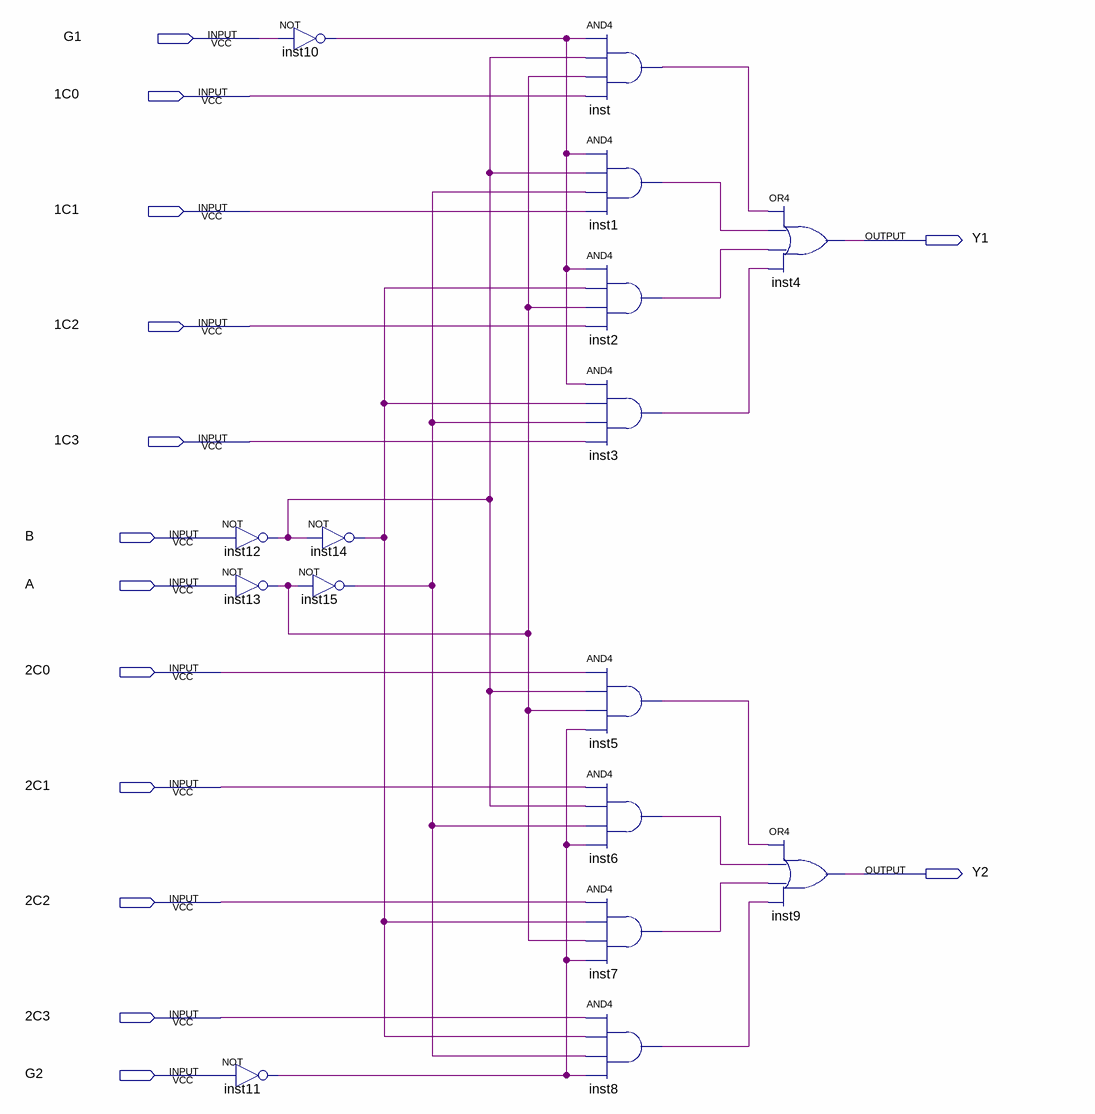
[diagram p0: schematic sheet]
// Quartus schematic ci74153.bdf as structural Verilog: 16 symbols, 14 pins
module ci74153 (
  input  G1,
  input  \1C0 ,
  input  \1C1 ,
  input  \1C2 ,
  input  \1C3 ,
  input  B,
  input  A,
  input  \2C0 ,
  input  \2C1 ,
  input  \2C2 ,
  input  \2C3 ,
  input  G2,
  output Y1,
  output Y2
);

  wire inst1_out, inst2_out, inst3_out, inst5_out, inst6_out, inst7_out, inst8_out, inst10_out, inst11_out,
       inst12_out, inst13_out, inst14_out, inst15_out, inst_out;

  not inst12 (inst12_out, B);
  not inst13 (inst13_out, A);
  not inst11 (inst11_out, G2);
  not inst10 (inst10_out, G1);
  not inst15 (inst15_out, inst13_out);
  not inst14 (inst14_out, inst12_out);
  and inst (inst_out, inst10_out, inst12_out, inst13_out, \1C0 );
  and inst1 (inst1_out, inst10_out, inst12_out, inst15_out, \1C1 );
  and inst2 (inst2_out, inst10_out, inst14_out, inst13_out, \1C2 );
  and inst3 (inst3_out, inst10_out, inst14_out, inst15_out, \1C3 );
  and inst5 (inst5_out, \2C0 , inst12_out, inst13_out, inst11_out);
  and inst6 (inst6_out, \2C1 , inst12_out, inst15_out, inst11_out);
  and inst7 (inst7_out, \2C2 , inst14_out, inst13_out, inst11_out);
  and inst8 (inst8_out, \2C3 , inst14_out, inst15_out, inst11_out);
  or inst4 (Y1, inst_out, inst1_out, inst2_out, inst3_out);
  or inst9 (Y2, inst5_out, inst6_out, inst7_out, inst8_out);
endmodule
